# EAGLE design DAUGHTER_SENSOR (EAGLE 7.6.0)
DAUGHTER CARD SENSORS

## Sheet 1 of 3: HDK INTERFACE
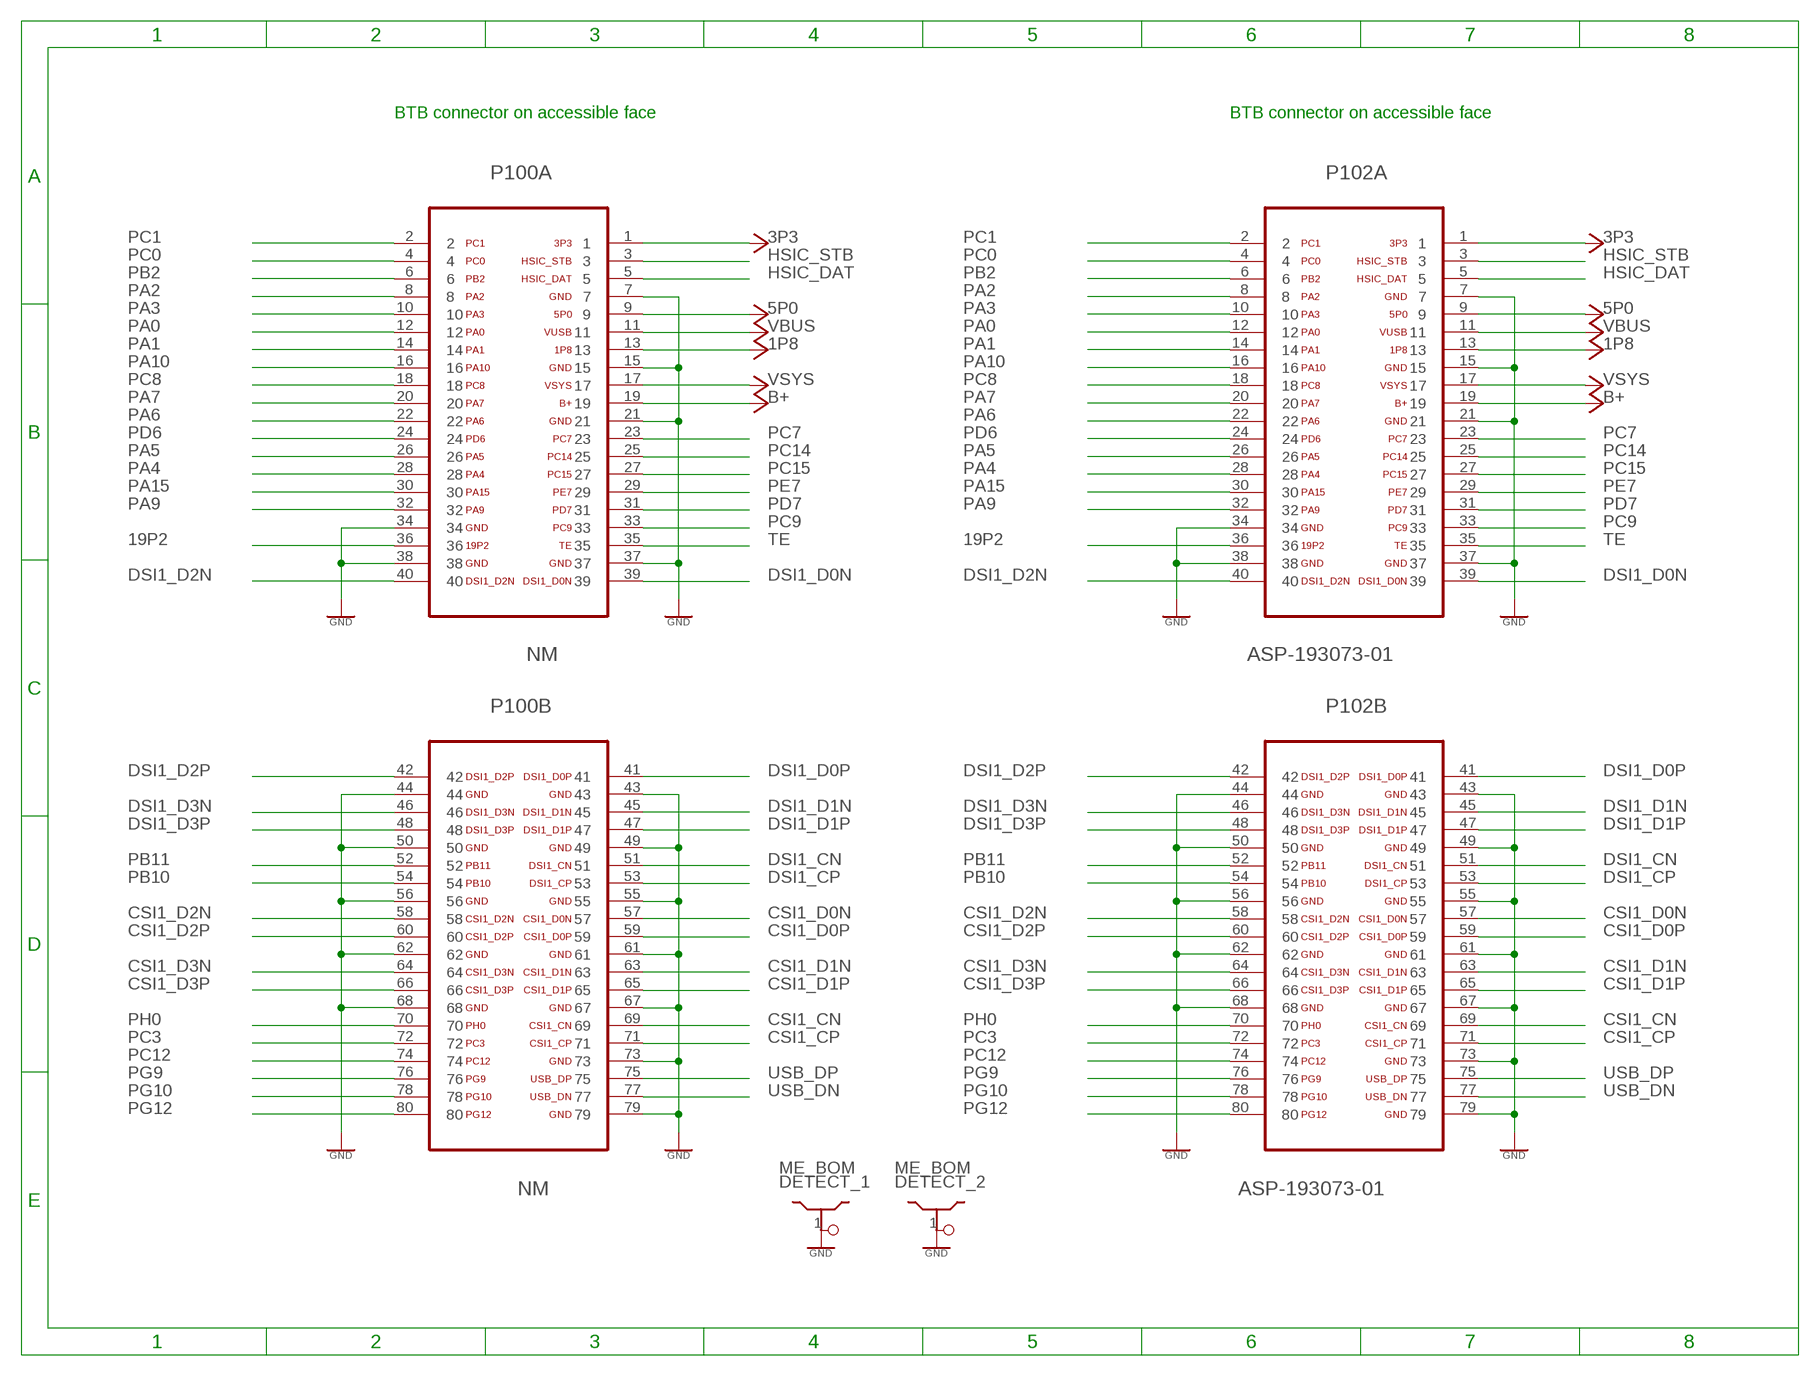
[diagram p0: schematic, sheet 1]

### Parts
DETECT_1  ME_BOM  SHIELDDETECT  [PLUG]
DETECT_2  ME_BOM  SHIELDDETECT  [PLUG]
P100  NM  CLM-140-02-L-D-KGOLD  [CLM-140-02-L-D-K_GOLD]
P102  ASP-193073-01  FTMH-140-02-L-DV-ES-P-TR  [FTMH-140-02-L-DV-ES-P-TR]

### Nets
1P8: P100.13 P102.13 ; also sheet 2,3
3P3: P100.1 P102.1 ; also sheet 2,3
5P0: P100.9 P102.9
19P2: P100.36 P102.36
B+: P100.19 P102.19
CSI1_CN: P100.69 P102.69
CSI1_CP: P100.71 P102.71
CSI1_D0N: P100.57 P102.57
CSI1_D0P: P100.59 P102.59
CSI1_D1N: P100.63 P102.63
CSI1_D1P: P100.65 P102.65
CSI1_D2N: P100.58 P102.58
CSI1_D2P: P100.60 P102.60
CSI1_D3N: P100.64 P102.64
CSI1_D3P: P100.66 P102.66
DSI1_CN: P100.51 P102.51
DSI1_CP: P100.53 P102.53
DSI1_D0N: P100.39 P102.39
DSI1_D0P: P100.41 P102.41
DSI1_D1N: P100.45 P102.45
DSI1_D1P: P100.47 P102.47
DSI1_D2N: P100.40 P102.40
DSI1_D2P: P100.42 P102.42
DSI1_D3N: P100.46 P102.46
DSI1_D3P: P100.48 P102.48
GND: DETECT_1.1 DETECT_2.1 P100.7 P100.15 P100.21 P100.34 P100.37 P100.38 P100.43 P100.44 P100.49 P100.50 P100.55 P100.56 P100.61 P100.62 P100.67 P100.68 P100.73 P100.79 P102.7 P102.15 P102.21 P102.34 P102.37 P102.38 P102.43 P102.44 P102.49 P102.50 P102.55 P102.56 P102.61 P102.62 P102.67 P102.68 P102.73 P102.79 ; also sheet 2,3
HSIC_DAT: P100.5 P102.5
HSIC_STB: P100.3 P102.3
PA0: P100.12 P102.12
PA1: P100.14 P102.14
PA2: P100.8 P102.8
PA3: P100.10 P102.10
PA4: P100.28 P102.28
PA5: P100.26 P102.26
PA6: P100.22 P102.22
PA7: P100.20 P102.20
PA9: P100.32 P102.32
PA10: P100.16 P102.16
PA15: P100.30 P102.30
PB2: P100.6 P102.6
PB10: P100.54 P102.54 ; also sheet 2
PB11: P100.52 P102.52 ; also sheet 2
PC0: P100.4 P102.4 ; also sheet 3
PC1: P100.2 P102.2 ; also sheet 3
PC3: P100.72 P102.72 ; also sheet 3
PC7: P100.23 P102.23
PC8: P100.18 P102.18
PC9: P100.33 P102.33
PC12: P100.74 P102.74
PC14: P100.25 P102.25
PC15: P100.27 P102.27
PD6: P100.24 P102.24
PD7: P100.31 P102.31
PE7: P100.29 P102.29
PG9: P100.76 P102.76 ; also sheet 2
PG10: P100.78 P102.78 ; also sheet 3
PG12: P100.80 P102.80
PH0: P100.70 P102.70
TE: P100.35 P102.35
USB_DN: P100.77 P102.77
USB_DP: P100.75 P102.75
VBUS: P100.11 P102.11
VSYS: P100.17 P102.17

### Notes on the sheet
- BTB connector on accessible face | BTB connector on accessible face

## Sheet 2 of 3: Identification
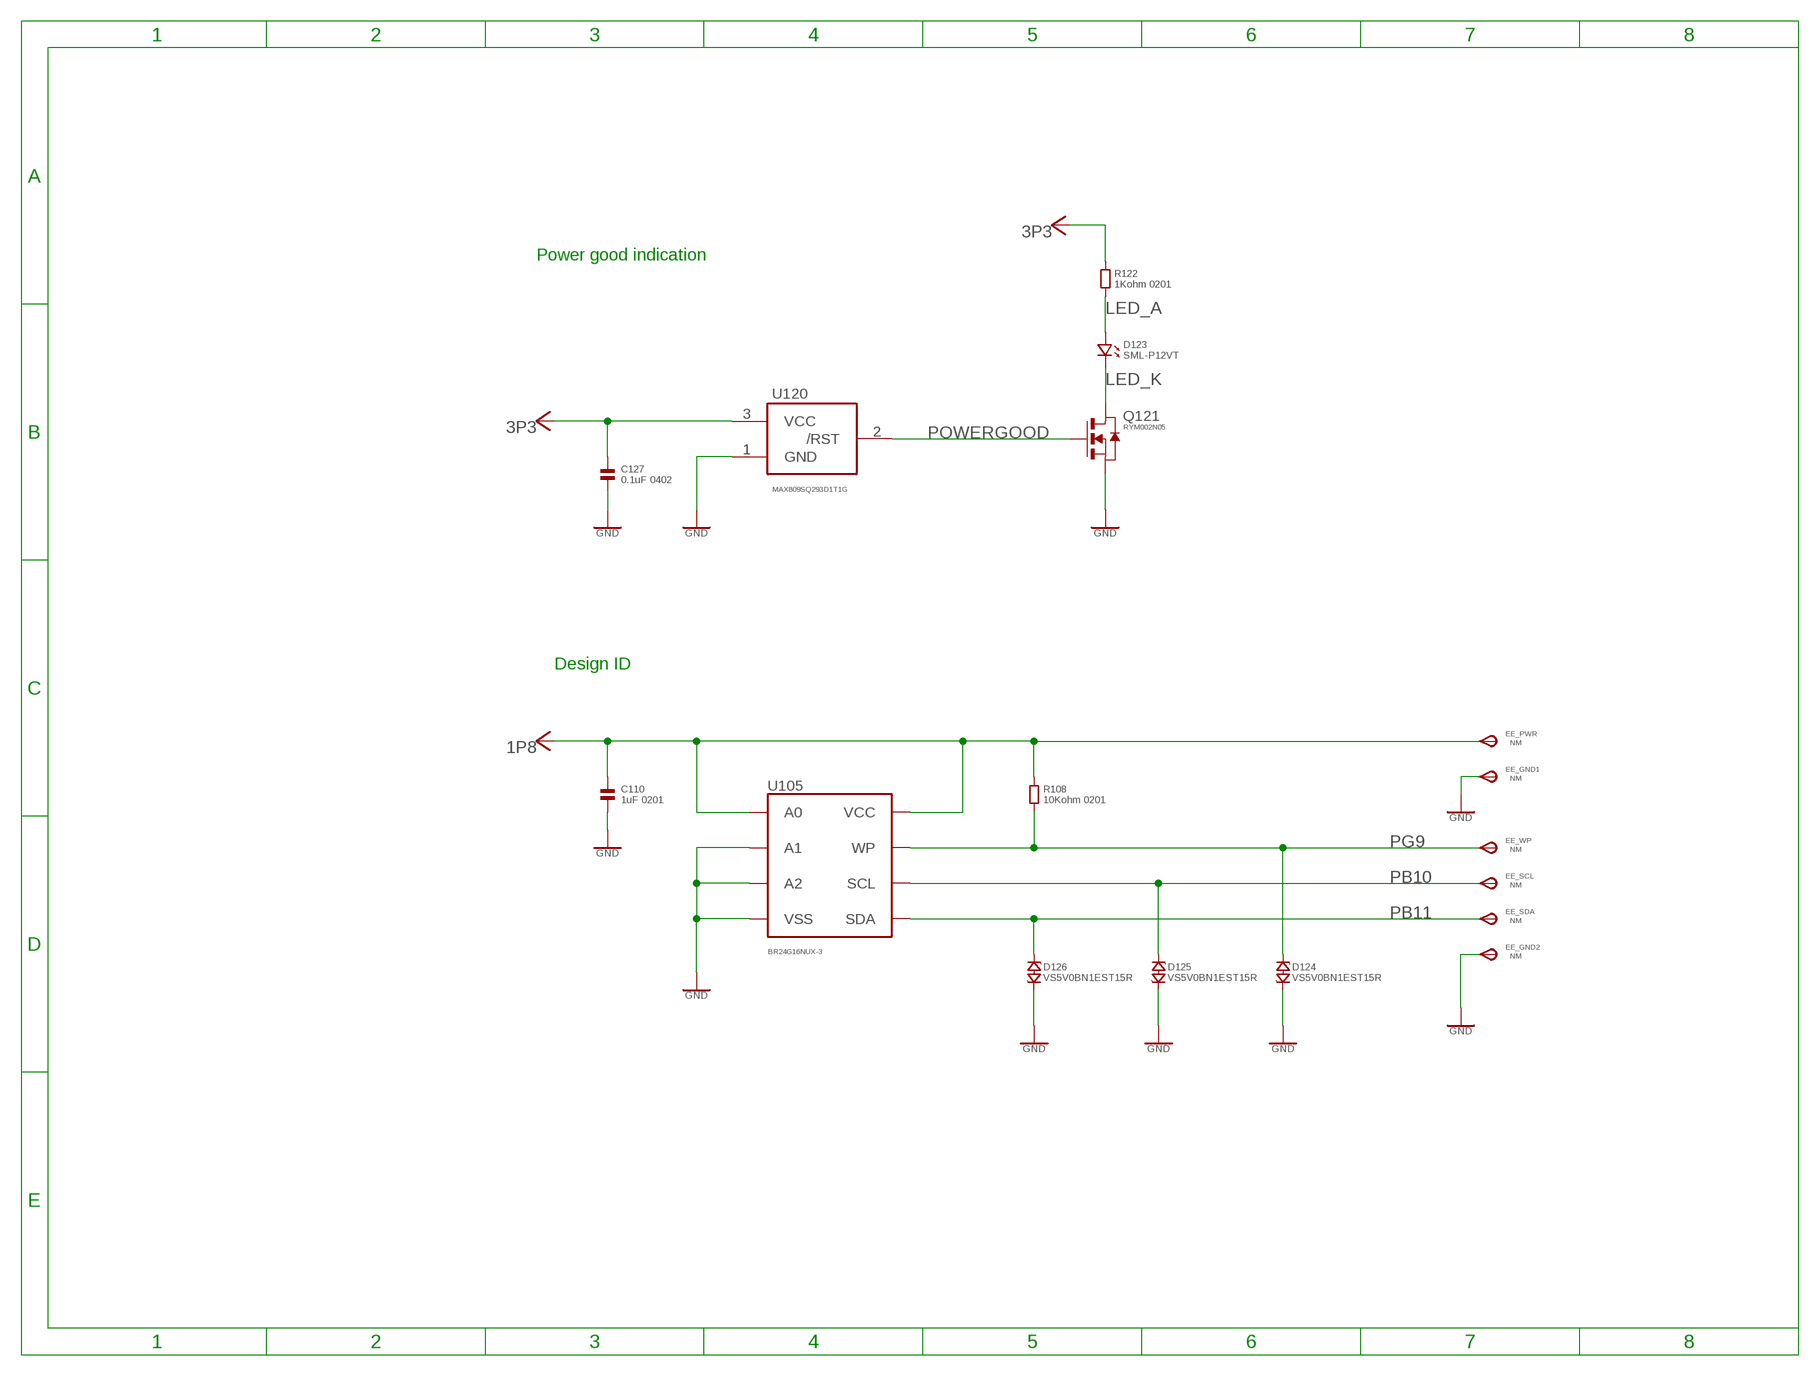
[diagram p1: schematic, sheet 2]

### Parts
C110  1uF 0201  CAPACITOR.0201  [0201]
C127  0.1uF 0402  CAPACITOR.0402  [0402]
D123  SML-P12VT  LED.0503  [0503.LED]
D124  VS5V0BN1EST15R  ESD_VARISTOR.0201  [CHIP_0201]
D125  VS5V0BN1EST15R  ESD_VARISTOR.0201  [CHIP_0201]
D126  VS5V0BN1EST15R  ESD_VARISTOR.0201  [CHIP_0201]
EE_GND1  NM  TPSTP11R  [TP11R]
EE_GND2  NM  TPSTP11R  [TP11R]
EE_PWR  NM  TPSTP11R  [TP11R]
EE_SCL  NM  TPSTP11R  [TP11R]
EE_SDA  NM  TPSTP11R  [TP11R]
EE_WP  NM  TPSTP11R  [TP11R]
Q121  RYM002N05  FET-NRYM002N05  [VMT3]
R108  10Kohm 0201  RESISTOR.0201  [0201]
R122  1Kohm 0201  RESISTOR.0201  [0201]
U105  BR24G16NUX-3  EEPROMDFN8  [DFN-8]
U120  MAX809SQ293D1T1G  MAX809  [SC70-3L]

### Nets
1P8: C110.1 EE_PWR.TP(PP) R108.1 U105.P$1(A0) U105.P$8(VCC) ; also sheet 1,3
3P3: C127.1 R122.1 U120.3(VCC) ; also sheet 1,3
GND: C110.2 C127.2 D124.P$2 D125.P$2 D126.P$2 EE_GND1.TP(PP) EE_GND2.TP(PP) Q121.2(S) U105.P$2(A1) U105.P$3(A2) U105.P$4(VSS) U105.P$9(VSS) U120.1(GND) ; also sheet 1,3
LED_A: D123.P$1 R122.2
LED_K: D123.P$2 Q121.3(D)
PB10: D125.P$1 EE_SCL.TP(PP) U105.P$6(SCL) ; also sheet 1
PB11: D126.P$1 EE_SDA.TP(PP) U105.P$5(SDA) ; also sheet 1
PG9: D124.P$1 EE_WP.TP(PP) R108.2 U105.P$7(WP) ; also sheet 1
POWERGOOD: Q121.1(G) U120.2(/RST)

### Notes on the sheet
- Power good indication
- Design ID

## Sheet 3 of 3: SENSOR
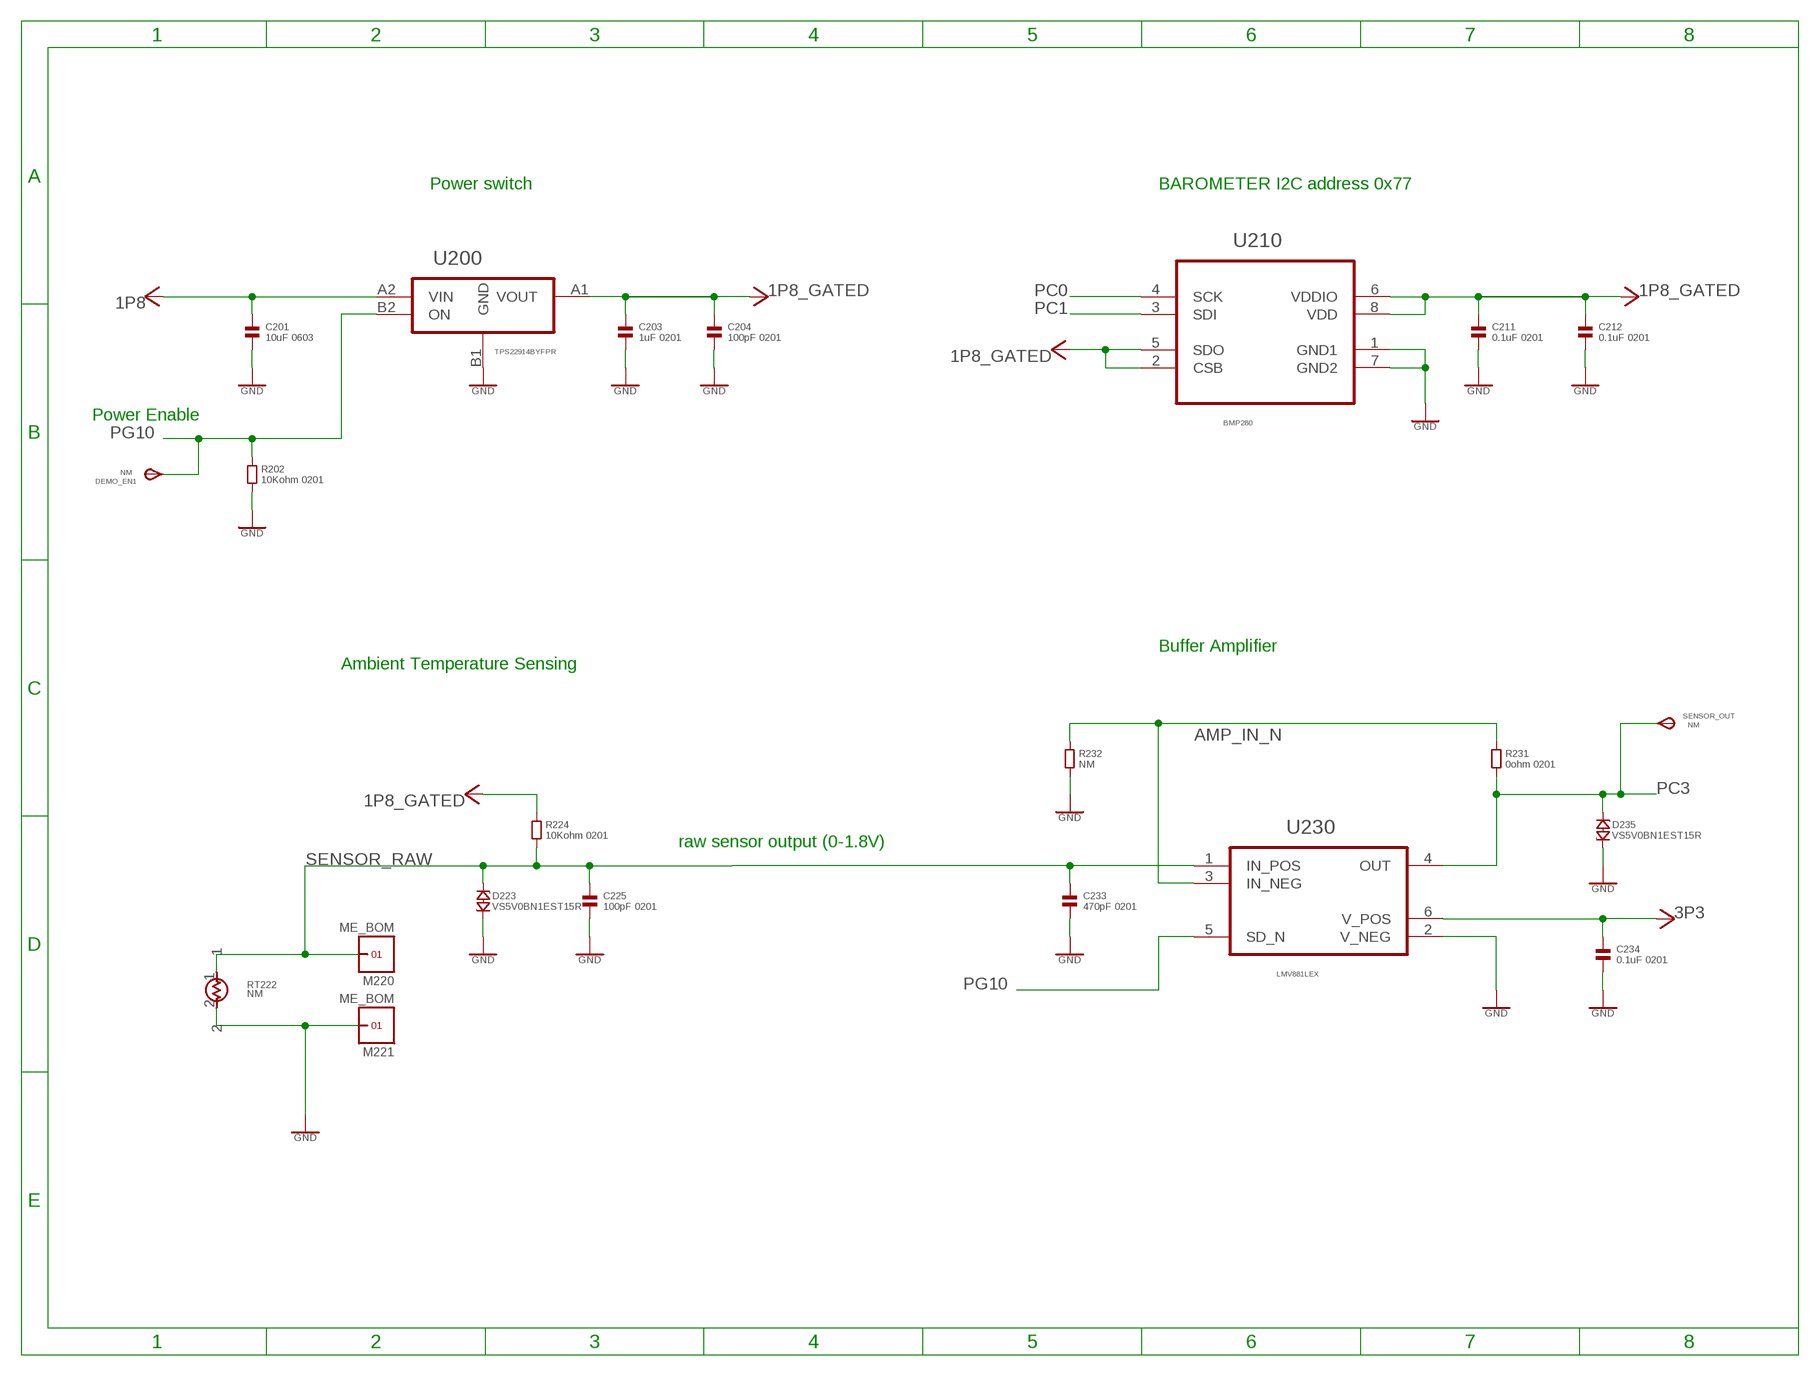
[diagram p2: schematic, sheet 3]

### Parts
C201  10uF 0603  CAPACITOR.0603  [0603]
C203  1uF 0201  CAPACITOR.0201  [0201]
C204  100pF 0201  CAPACITOR.0201  [0201]
C211  0.1uF 0201  CAPACITOR.0201  [0201]
C212  0.1uF 0201  CAPACITOR.0201  [0201]
C225  100pF 0201  CAPACITOR.0201  [0201]
C233  470pF 0201  CAPACITOR.0201  [0201]
C234  0.1uF 0201  CAPACITOR.0201  [0201]
D223  VS5V0BN1EST15R  ESD_VARISTOR.0201  [CHIP_0201]
D235  VS5V0BN1EST15R  ESD_VARISTOR.0201  [CHIP_0201]
DEMO_EN1  NM  TPSTP11R  [TP11R]
M220  ME_BOM  UNVERSA_CONTACT  [UNIVERSAL_CONTACT]
M221  ME_BOM  UNVERSA_CONTACT  [UNIVERSAL_CONTACT]
R202  10Kohm 0201  RESISTOR.0201  [0201]
R224  10Kohm 0201  RESISTOR.0201  [0201]
R231  0ohm 0201  RESISTOR.0201  [0201]
R232  NM  RESISTOR.0201  [0201]
RT222  NM  THERMISTOR  [0201]
SENSOR_OUT  NM  TPSTP11R  [TP11R]
U200  TPS22914BYFPR  [BGA0_75SQ_PS0_4_P4]
U210  BMP280  [LGA2X2_5PS0_65_P8]
U230  LMV881LEX  [DFN1_5X1PS0_5P6]

### Nets
1P8: C201.1 U200.A2(VIN) ; also sheet 1,2
1P8_GATED: C203.1 C204.1 C211.1 C212.1 R224.1 U200.A1(VOUT) U210.2(CSB) U210.5(SDO) U210.6(VDDIO) U210.8(VDD)
3P3: C234.1 U230.6(V_POS) ; also sheet 1,2
AMP_IN_N: R231.1 R232.1 U230.3(IN_NEG)
GND: C201.2 C203.2 C204.2 C211.2 C212.2 C225.2 C233.2 C234.2 D223.P$2 D235.P$2 M221.G1 R202.2 R232.2 RT222.2 U200.B1(GND) U210.1(GND1) U210.7(GND2) U230.2(V_NEG) ; also sheet 1,2
PC0: U210.4(SCK) ; also sheet 1
PC1: U210.3(SDI) ; also sheet 1
PC3: D235.P$1 R231.2 SENSOR_OUT.TP(PP) U230.4(OUT) ; also sheet 1
PG10: DEMO_EN1.TP(PP) R202.1 U200.B2(ON) U230.5(SD_N) ; also sheet 1
SENSOR_RAW: C225.1 C233.1 D223.P$1 M220.G1 R224.2 RT222.1 U230.1(IN_POS)

### Notes on the sheet
- Power switch | BAROMETER I2C address 0x77
- Power Enable
- Buffer Amplifier
- Ambient Temperature Sensing
- raw sensor output (0-1.8V)

## Library data of the parts
C110 C127 C201 C203 C204 C211 C212 C225 C233 C234 = MOTO_LIB:CAPACITOR: Ceramic Capacitor, Generic
D123 = MOTO_LIB:LED: LED GENERIC, single, 2 pin; MPN: SML-P12VT; SUPPLIER: ROHM
D124-D126 D223 D235 = MOTO_LIB:ESD_VARISTOR: GENERIC varistor,single, 2 pin; MPN: VS5V0BN1EST15R; SUPPLIER: ROHM
DEMO_EN1 EE_GND1 EE_GND2 EE_PWR EE_SCL EE_SDA EE_WP SENSOR_OUT = MOTO_LIB:TPS: TEST Point, 1mm diameter, gold
DETECT_1 DETECT_2 = MOTO_LIB:SHIELD: Shield, Custom; MPN: refer to ME BOM; SUPPLIER: ref to ME BOM
M220 M221 = MOTO_LIB:UNVERSA_CONTACT: Universal contact, Generic; MPN: refer to ME BOM; SUPPLIER: ref to ME BOM
P100 = MOTO_LIB:CLM-140-02-L-D-K: MICRO SOCKET, 1.0MM pitch, SMD, 2X40WAY, Female; MPN: CLM-140-02-L-D-K; SUPPLIER: SAMTEC
P102 = MOTO_LIB:FTMH-140-02-L-DV-ES-P-TR: MICRO SOCKET, 1.0MM, SMD, 2X40WAY, MALE; MPN: ASP-193073-01; SUPPLIER: SAMTEC
Q121 = MOTO_LIB:FET-N: Generic NMOS FET; MPN: RYM002N05; SUPPLIER: ROHM
R108 R122 R202 R224 R231 R232 = MOTO_LIB:RESISTOR: Resistor - Generic
RT222 = MOTO_LIB:THERMISTOR: Thmistor, NTC 10Khm 3%, 0201; MPN: NCP03XV103XV103E05RL/NTCG0603UH103HT; SUPPLIER: MURARA/TDK
U105 = MOTO_LIB:EEPROM: I2C EE PROM, 8 pin; MPN: BR24G16NUX-3; SUPPLIER: ROHM
U120 = MOTO_LIB:MAX809: 3-Pin Microprocessor Reset Circuit; MPN: MAX809SQ293D1T1; SUPPLIER: ON-SEMI
U200 = MOTO_LIB:TPS22914BYFPR: 5V load switch; MPN: TPS22914BYFPR; SUPPLIER: TI
U210 = MOTO_LIB:BMP280: BAROMETER BMP280; MPN: BMP280; SUPPLIER: BOSCH
U230 = MOTO_LIB:LMV881LEX: LOW NOISE OPAMP with Shutdown.; MPN: LMV881LEX; SUPPLIER: TI

## Board
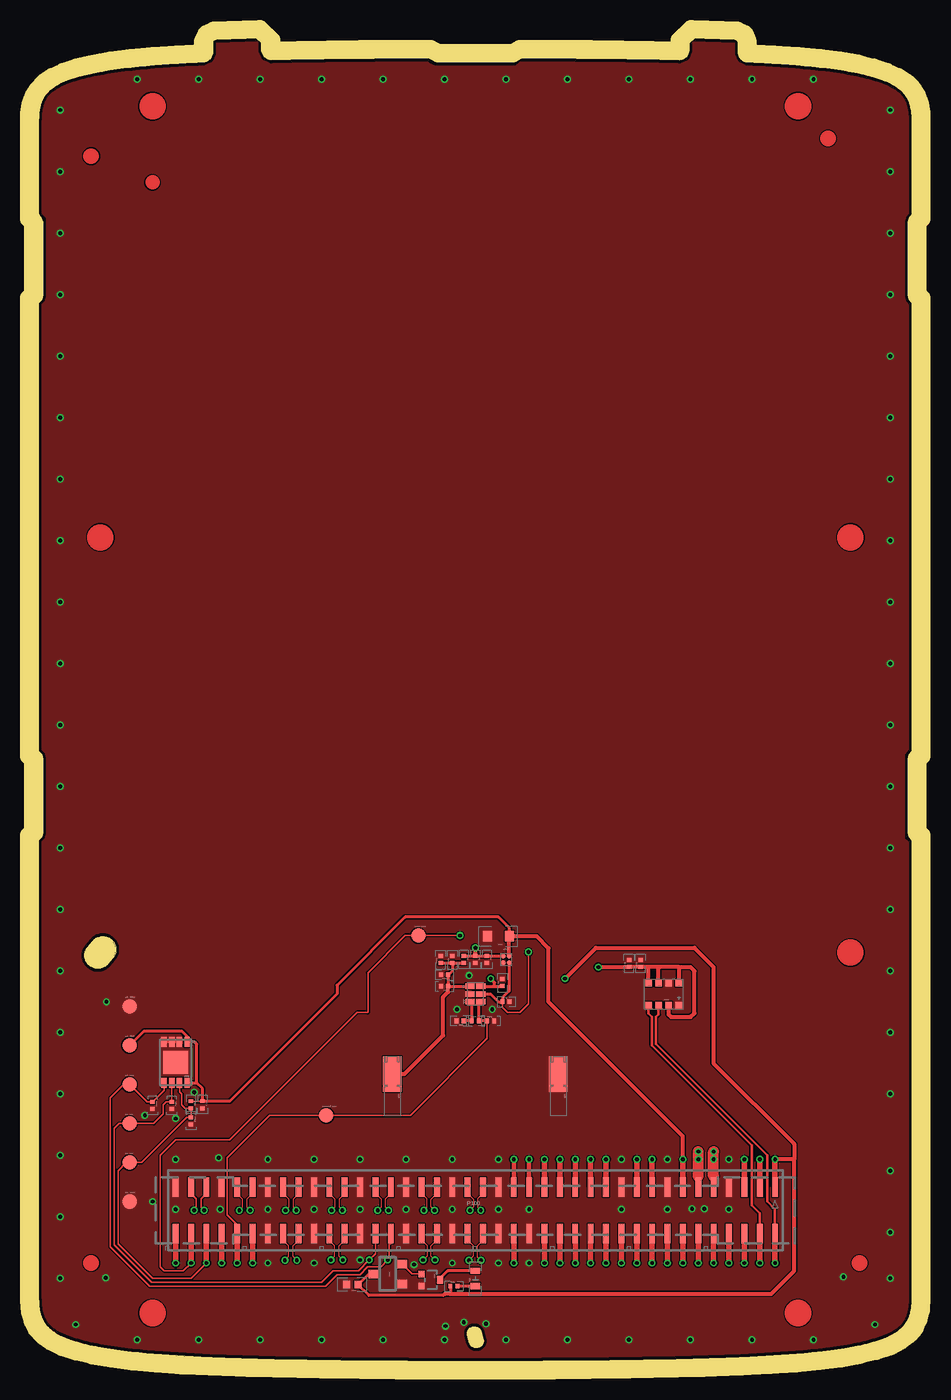
[diagram p3: board, top side]
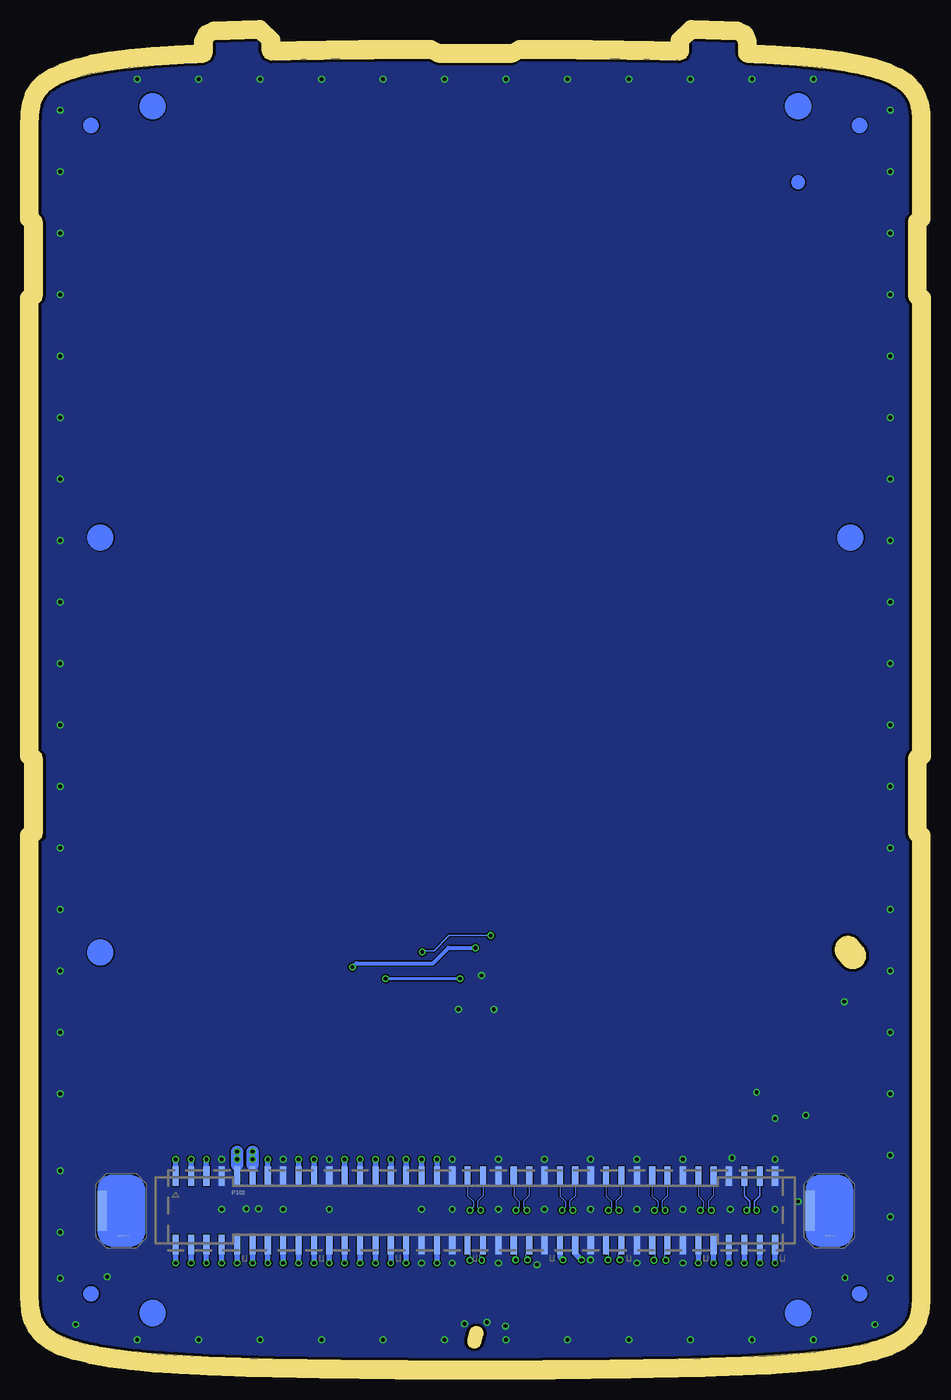
[diagram p4: board, bottom side, seen from below]

Size 56.85 x 86.03 mm. Coordinates in mm from the lower left corner, seen from the top.
Outline: 357 segments
Copper layers (1*2*15*16): Top 0.02mm / dielectric 0.045mm / Route2 0.016mm / dielectric 0.711mm / Route15 0.016mm / dielectric 0.045mm / Bottom 0.02mm
Design rules "constraint": minimum track width 0.08mm, minimum drill 0.25mm, track to track 0.08mm, track to pad 0.08mm, pad to pad 0.08mm, via to via 0.08mm, smd to smd 0.08mm, copper to edge 0.2mm, drill to drill 0.2mm, minimum pad ring 0.1mm, minimum via ring 0.1mm, stop-mask expansion 0mil, vias tented up to drill 0.25mm, thermal gap 0mil
Milling: 125 lines

### Footprints (pad centres in the part's own frame; a part is rotated, then mirrored left to right if it is on the bottom)
0201 = smd 0.25 x 0.3: 1 -0.23,0; 2 0.23,0
0402 = smd 0.45 x 0.5: 1 -0.37,0; 2 0.37,0
0603 = smd 0.58 x 0.68: 1 -0.71,0; 2 0.71,0
0503.LED = smd 0.4 x 0.6: P$1 -0.495,0; P$2 0.495,0
CHIP_0201 = smd 0.25 x 0.3: P$1 -0.23,0; P$2 0.23,0
TP11R = smd 0.95 x 0.95: TP 0,0
PLUG = smd 0.6 x 2.6: 1 -1.25,0
UNIVERSAL_CONTACT = smd 2.3 x 1.2: G1 -0.8,0
CLM-140-02-L-D-K_GOLD = smd 0.38 x 1.27: 1 19.5,1.52; 2 19.5,-1.52; 3 18.5,1.52; 4 18.5,-1.52; 5 17.5,1.52; 6 17.5,-1.52; 7 16.5,1.52; 8 16.5,-1.52; 9 15.5,1.52; 10 15.5,-1.52; 11 14.5,1.52; 12 14.5,-1.52; 13 13.5,1.52; 14 13.5,-1.52; 15 12.5,1.52; 16 12.5,-1.52; 17 11.5,1.52; 18 11.5,-1.52; 19 10.5,1.52; 20 10.5,-1.52; 21 9.5,1.52; 22 9.5,-1.52; 23 8.5,1.52; 24 8.5,-1.52; 25 7.5,1.52; 26 7.5,-1.52; 27 6.5,1.52; 28 6.5,-1.52; 29 5.5,1.52; 30 5.5,-1.52; 31 4.5,1.52; 32 4.5,-1.52; 33 3.5,1.52; 34 3.5,-1.52; 35 2.5,1.52; 36 2.5,-1.52; 37 1.5,1.52; 38 1.5,-1.52; 39 0.5,1.52; 40 0.5,-1.52; 41 -0.5,1.52; 42 -0.5,-1.52; 43 -1.5,1.52; 44 -1.5,-1.52; 45 -2.5,1.52; 46 -2.5,-1.52; 47 -3.5,1.52; 48 -3.5,-1.52; 49 -4.5,1.52; 50 -4.5,-1.52; 51 -5.5,1.52; 52 -5.5,-1.52; 53 -6.5,1.52; 54 -6.5,-1.52; 55 -7.5,1.52; 56 -7.5,-1.52; 57 -8.5,1.52; 58 -8.5,-1.52; 59 -9.5,1.52; 60 -9.5,-1.52; 61 -10.5,1.52; 62 -10.5,-1.52; 63 -11.5,1.52; 64 -11.5,-1.52; 65 -12.5,1.52; 66 -12.5,-1.52; 67 -13.5,1.52; 68 -13.5,-1.52; 69 -14.5,1.52; 70 -14.5,-1.52; 71 -15.5,1.52; 72 -15.5,-1.52; 73 -16.5,1.52; 74 -16.5,-1.52; 75 -17.5,1.52; 76 -17.5,-1.52; 77 -18.5,1.52; 78 -18.5,-1.52; 79 -19.5,1.52; 80 -19.5,-1.52
FTMH-140-02-L-DV-ES-P-TR = smd 0.4 x 1.263: 1 -19.5,2.223; 2 -19.5,-2.223; 3 -18.5,2.223; 4 -18.5,-2.223; 5 -17.5,2.223; 6 -17.5,-2.223; 7 -16.5,2.223; 8 -16.5,-2.223; 9 -15.5,2.223; 10 -15.5,-2.223; 11 -14.5,2.223; 12 -14.5,-2.223; 13 -13.5,2.223; 14 -13.5,-2.223; 15 -12.5,2.223; 16 -12.5,-2.223; 17 -11.5,2.223; 18 -11.5,-2.223; 19 -10.5,2.223; 20 -10.5,-2.223; 21 -9.5,2.223; 22 -9.5,-2.223; 23 -8.5,2.223; 24 -8.5,-2.223; 25 -7.5,2.223; 26 -7.5,-2.223; 27 -6.5,2.223; 28 -6.5,-2.223; 29 -5.5,2.223; 30 -5.5,-2.223; 31 -4.5,2.223; 32 -4.5,-2.223; 33 -3.5,2.223; 34 -3.5,-2.223; 35 -2.5,2.223; 36 -2.5,-2.223; 37 -1.5,2.223; 38 -1.5,-2.223; 39 -0.5,2.223; 40 -0.5,-2.223; 41 0.5,2.223; 42 0.5,-2.223; 43 1.5,2.223; 44 1.5,-2.223; 45 2.5,2.223; 46 2.5,-2.223; 47 3.5,2.223; 48 3.5,-2.223; 49 4.5,2.223; 50 4.5,-2.223; 51 5.5,2.223; 52 5.5,-2.223; 53 6.5,2.223; 54 6.5,-2.223; 55 7.5,2.223; 56 7.5,-2.223; 57 8.5,2.223; 58 8.5,-2.223; 59 9.5,2.223; 60 9.5,-2.223; 61 10.5,2.223; 62 10.5,-2.223; 63 11.5,2.223; 64 11.5,-2.223; 65 12.5,2.223; 66 12.5,-2.223; 67 13.5,2.223; 68 13.5,-2.223; 69 14.5,2.223; 70 14.5,-2.223; 71 15.5,2.223; 72 15.5,-2.223; 73 16.5,2.223; 74 16.5,-2.223; 75 17.5,2.223; 76 17.5,-2.223; 77 18.5,2.223; 78 18.5,-2.223; 79 19.5,2.223; 80 19.5,-2.223
VMT3 = smd 0.42 x 0.4: 1 -0.4,-0.6; 2 0.4,-0.6 | smd 0.52 x 0.4: 3 0,0.6
DFN-8 = smd 0.35 x 0.65: P$1 -0.75,-1.325; P$2 -0.25,-1.325; P$3 0.25,-1.325; P$4 0.75,-1.325; P$5 0.75,1.325; P$6 0.25,1.325; P$7 -0.25,1.325; P$8 -0.75,1.325 | smd 1.6 x 1.5: P$9 0,0
SC70-3L = smd 0.55 x 0.63: 1 -0.65,-0.94; 3 0,0.94 | smd 0.555 x 0.63: 2 0.65,-0.94
BGA0_75SQ_PS0_4_P4 = smd 0.32 x 0.32: A1 -0.2,0.2; A2 0.2,0.2; B1 -0.2,-0.2; B2 0.2,-0.2
LGA2X2_5PS0_65_P8 = smd 0.45 x 0.45: 1 -0.975,0.725; 2 -0.325,0.725; 3 0.325,0.725; 4 0.975,0.725; 5 0.975,-0.725; 6 0.325,-0.725; 7 -0.325,-0.725; 8 -0.975,-0.725
DFN1_5X1PS0_5P6 = smd 0.35 x 0.6: 1 0.5,0.35; 2 0,0.35; 3 -0.5,0.35; 4 -0.5,-0.35; 5 0,-0.35; 6 0.5,-0.35

### Placement (x,y rotation side)
C110  10.67,16.67 270 top
C127  20.42,4.97 180 top
C201  29.92,27.62 180 top
C203  29.17,26.12 270 top
C204  28.42,26.12 270 top
C211  39.17,25.87 90 top
C212  38.42,25.87 90 top
C225  26.17,26.12 90 top
C233  26.92,26.12 90 top
C234  30.17,24.62 90 top
D123  28.42,5.37 90 top
D124  9.92,15.62 270 top
D125  8.67,16.62 270 top
D126  7.42,16.62 270 top
D223  26.42,24.37 180 top
D235  29.42,22.12 0 top
DEMO_EN1  24.72,27.67 0 top
DETECT_1  51.45,9.77 0 bottom
DETECT_2  5.39,9.77 0 bottom
EE_GND1  5.92,10.37 0 top
EE_GND2  5.92,23.07 0 top
EE_PWR  5.92,20.53 0 top
EE_SCL  5.92,15.45 0 top
EE_SDA  5.92,17.99 0 top
EE_WP  5.92,12.91 0 top
M220  23.02,17.87 270 top
M221  33.82,17.87 270 top
P100  28.42,9.8 0 top
P102  28.42,9.8 0 bottom
Q121  25.52,5.27 270 top
R108  9.92,16.67 270 top
R122  27.02,4.87 0 top
R202  30.42,23.37 0 top
R224  27.67,26.12 270 top
R231  28.42,22.12 0 top
R232  27.42,22.12 180 top
RT222  26.42,25.12 180 top
SENSOR_OUT  18.72,15.97 0 top
U105  8.92,19.42 180 top
U120  22.72,5.67 90 top
U200  30.42,26.12 0 top
U210  40.67,23.87 180 top
U230  28.42,23.87 90 top

### Tracks (layer width: path | path; a pad name or v marks a point on that pad's centre or on a via)
1P8  (via drill 0.25)
  Top 0.1: R108.1 C110.1
  Top 0.2: EE_PWR.TP 6.86,21.47 9.32,21.47 9.67,21.12 U105.P$1 10.15,20.75 10.3,20.6 10.3,18.1 | U105.P$8 10.3,18.1 | 10.3,18.1 10.67,17.72 C110.1 12.45,16.9 19.42,23.87 19.42,24.44 23.86,28.87 29.92,28.87 30.63,28.16 C201.1
  Top 0.25: C201.1 32.42,27.62 33.19,26.86 33.19,23.36 41.92,14.62 v41.92,13.12 | U200.A2 C201.1
  Top 0.35: C201.1 | P100.13 v41.92,13.12
  Bottom 0.35: P102.13 v41.92,13.12
1P8_GATED  (via drill 0.25)
  Top 0.2: U200.A1 30.19,26.35 C203.1 C204.1 R224.1
  Top 0.25: C204.1 v28.42,26.87 | v36.42,25.62 38.4,25.62 C212.1 C211.1 39.19,25.62 39.67,25.62 | 41.65,25.62 41.65,24.62 U210.8 | U210.2 41,22.55 41.17,22.37 42.42,22.37 42.67,22.62 42.67,25.37 | 42.67,25.37 42.42,25.62 | 42.42,25.62 42.67,25.37 | 41.65,25.62 41.67,25.62 42.42,25.62 | 41.65,25.62 40.42,25.62 | 40.42,25.62 39.67,25.62 | U210.6 40.35,25.55 40.42,25.62 | U210.5 39.7,25.6 39.67,25.62
  Bottom 0.25: v28.42,26.87 30.17,26.87 31.17,25.87 36.17,25.87 v36.42,25.62
3P3  (via drill 0.25)
  Top 0.2: U230.6 29.67,24.37 | 29.67,24.37 30.15,24.37 C234.1 | 29.67,24.37 29.67,24.62 v29.42,24.87 | U120.3 21.49,5.67 C127.1 21.49,4.27 26.32,4.27 26.42,4.37 | R122.1 26.79,4.37
  Top 0.25: v34.26,24.87 36.26,26.87 42.67,26.87 43.92,25.62 43.92,19.37 49.17,14.12 49.17,13.12 | 49.17,13.12 v47.92,13.12 | 26.42,4.37 26.79,4.37 47.67,4.37 49.17,5.87 49.17,13.12
  Top 0.35: P100.1 v47.92,13.12
  Bottom 0.2: v29.42,24.87 v34.26,24.87
  Bottom 0.35: P102.1 v47.92,13.12
5P0  (via drill 0.25)
  Top 0.25: P100.9 P102.9
  Top 0.7: P102.9 v43.92,13.62
  Bottom 0.4: P102.9 43.92,12.77
  Bottom 0.8: 43.92,12.77 v43.92,13.12 v43.92,13.62
19P2  (via drill 0.25)
  Top 0.35: P100.36 v30.92,6.37
  Bottom 0.35: v30.92,6.37 P102.36
AMP_IN_N
  Top 0.2: R232.1 R231.1 28.19,23.25 U230.3
B+  (via drill 0.25)
  Top 0.35: P100.19 v38.92,13.12
  Bottom 0.35: v38.92,13.12 P102.19
CSI1_CN  (via drill 0.25)
  Top 0.08: P100.69 13.92,10.9 13.57,10.55 13.57,10 v13.77,9.8
  Bottom 0.08: P102.69 13.92,10.75 13.57,10.4 13.57,10 v13.77,9.8
CSI1_CP  (via drill 0.25)
  Top 0.08: P100.71 12.92,10.9 13.29,10.53 13.29,10.02 v13.07,9.8
  Bottom 0.08: P102.71 12.92,10.75 13.27,10.4 13.27,10 v13.07,9.8
CSI1_D0N  (via drill 0.25)
  Top 0.08: P100.57 19.92,10.9 19.55,10.53 19.55,10.02 v19.77,9.8
  Bottom 0.08: P102.57 19.92,10.75 19.57,10.4 19.57,10 v19.77,9.8
CSI1_D0P  (via drill 0.25)
  Top 0.08: P100.59 18.92,10.9 19.27,10.55 19.27,10 v19.07,9.8
  Bottom 0.08: P102.59 18.92,10.75 19.29,10.38 19.29,10.02 v19.07,9.8
CSI1_D1N  (via drill 0.25)
  Top 0.08: P100.63 16.92,10.9 16.55,10.53 16.55,10.02 v16.77,9.8
  Bottom 0.08: P102.63 16.92,10.75 16.55,10.38 16.55,10.02 v16.77,9.8
CSI1_D1P  (via drill 0.25)
  Top 0.08: 15.92,10.9 16.27,10.55 16.27,10 v16.07,9.8
  Top 0.1: P100.65 15.92,10.9
  Bottom 0.08: P102.65 15.92,10.75 16.27,10.4 16.27,10 v16.07,9.8
CSI1_D2N  (via drill 0.25)
  Top 0.08: P100.58 19.92,7.85 19.57,7.5 19.57,6.8 v19.8,6.58
  Bottom 0.08: P102.58 19.92,7.17 19.72,6.97 19.72,6.65 v19.8,6.58
CSI1_D2P  (via drill 0.25)
  Top 0.08: P100.60 18.92,7.85 19.27,7.5 19.27,6.82 v19.03,6.58
  Bottom 0.08: P102.60 18.92,7.15 19.12,6.95 19.12,6.67 v19.03,6.58
CSI1_D3N  (via drill 0.25)
  Top 0.08: P100.64 16.92,7.85 16.57,7.5 16.57,6.8 v16.81,6.57
  Bottom 0.08: P102.64 16.92,7.12 16.72,6.92 16.72,6.65 v16.81,6.57
CSI1_D3P  (via drill 0.25)
  Top 0.08: P100.66 15.92,7.85 16.27,7.5 16.27,6.8 v16.03,6.57
  Bottom 0.08: P102.66 15.92,7.12 16.12,6.92 16.12,6.65 v16.03,6.57
DSI1_CN  (via drill 0.25)
  Top 0.08: 22.92,10.9 22.55,10.53 22.55,10.02 v22.77,9.8
  Top 0.1: P100.51 22.92,10.9
  Bottom 0.08: P102.51 22.92,10.75 22.57,10.4 22.57,10 v22.77,9.8
DSI1_CP  (via drill 0.25)
  Top 0.08: P100.53 21.92,10.9 22.27,10.55 22.27,10 v22.07,9.8
  Bottom 0.08: P102.53 21.92,10.75 22.29,10.39 22.29,10.02 v22.07,9.8
DSI1_D0N  (via drill 0.25)
  Top 0.08: P100.39 28.92,10.9 28.57,10.55 28.57,10 v28.77,9.8
  Bottom 0.08: P102.39 28.92,10.75 28.55,10.38 28.55,10.02 v28.77,9.8
DSI1_D0P  (via drill 0.25)
  Top 0.08: P100.41 27.92,10.9 28.29,10.53 28.29,10.02 v28.07,9.8
  Bottom 0.08: P102.41 27.92,10.75 28.27,10.4 28.27,10 v28.07,9.8
DSI1_D1N  (via drill 0.25)
  Top 0.08: P100.45 25.92,10.9 25.55,10.53 25.55,10.02 v25.77,9.8
  Bottom 0.08: P102.45 25.92,10.75 25.57,10.4 25.57,10 v25.77,9.8
DSI1_D1P  (via drill 0.25)
  Top 0.08: P100.47 24.92,10.9 25.27,10.55 25.27,10 v25.07,9.8
  Bottom 0.08: P102.47 24.92,10.75 25.29,10.38 25.29,10.02 v25.07,9.8
DSI1_D2N  (via drill 0.25)
  Top 0.08: P100.40 28.92,7.85 28.57,7.5 28.57,6.76 v28.78,6.56
  Bottom 0.08: P102.40 28.92,7.17 28.72,6.97 28.72,6.61 v28.78,6.56
DSI1_D2P  (via drill 0.25)
  Top 0.08: P100.42 27.92,7.85 28.29,7.48 28.29,6.84 v28.01,6.56
  Bottom 0.08: P102.42 27.92,7.15 28.12,6.95 28.12,6.67 v28.01,6.56
DSI1_D3N  (via drill 0.25)
  Top 0.08: P100.46 25.92,7.87 25.56,7.5 25.55,6.82 v25.8,6.58
  Bottom 0.08: P102.46 25.92,7.17 25.72,6.97 25.72,6.65 v25.8,6.58
DSI1_D3P  (via drill 0.25)
  Top 0.08: P100.48 24.92,7.87 25.27,7.52 25.27,6.82 v25.03,6.58
  Bottom 0.08: P102.48 24.92,7.15 25.12,6.95 25.12,6.67 v25.03,6.58
GND  (via drill 0.25)
  Top 0.2: U105.P$4 U105.P$3 U105.P$2
  other vias: 14.42,1.37 10.42,1.37 6.42,1.37 22.42,1.37 18.42,1.37 26.42,1.37 30.42,1.37 34.42,1.37 38.42,1.37 42.42,1.37 46.42,1.37 50.42,1.37 54.42,2.37 55.42,8.37 55.42,5.37 55.42,12.37 55.42,17.37 55.42,21.37 55.42,25.37 55.42,29.37 55.42,33.37 55.42,37.37 55.42,41.37 55.42,45.37 55.42,49.37 55.42,53.37 55.42,57.37 55.42,61.37 55.42,65.37 55.42,69.37 55.42,73.37 55.42,77.37 55.42,81.37 50.42,83.37 46.42,83.37 42.42,83.37 38.42,83.37 34.42,83.37 30.42,83.37 26.42,83.37 22.42,83.37 18.42,83.37 14.42,83.37 10.42,83.37 6.42,83.37 1.42,81.37 1.42,77.37 1.42,73.37 1.42,69.37 1.42,65.37 1.42,61.37 1.42,57.37 1.42,53.37 1.42,49.37 1.42,45.37 1.42,41.37 1.42,37.37 1.42,33.37 1.42,29.37 1.42,25.37 4.42,23.37 1.42,21.37 1.42,17.37 1.42,13.37 1.42,9.37 1.42,5.37 2.42,2.37 8.92,13.12 11.72,13.22 14.92,13.12 17.92,13.12 20.92,13.12 23.92,13.12 26.92,13.12 29.92,13.12 29.92,9.87 31.92,9.87 26.92,9.87 23.92,9.87 20.92,9.87 17.92,9.87 14.92,9.87 11.82,9.87 8.92,9.87 7.42,10.37 8.92,15.77 10.12,17.47 14.92,6.37 17.92,6.37 20.92,6.57 24.42,6.27 26.92,6.37 29.92,6.37 31.92,6.37 44.92,9.87 42.52,9.9 43.32,9.9 40.92,9.87 37.92,9.87 37.92,13.12 40.92,13.12 44.92,13.12 29.52,22.87 28.02,25.07 27.22,22.87 6.92,15.97 29.12,2.42 27.67,2.52 26.47,2.27 52.37,5.47 4.37,5.42
  pour Top: 25.82,84.22 31.07,84.22 31.57,84.67 36.72,84.67 41.82,84.57 42.12,84.67 42.32,84.97 42.42,85.17 42.42,85.57 42.72,85.97 45.32,85.87 45.42,85.67 45.42,84.97 45.62,84.57 45.82,84.47 46.12,84.37 47.12,84.37 50.02,84.17 51.72,83.97 53.32,83.67 54.82,83.27 55.72,82.87 56.22,82.47 56.52,82.07 56.72,81.47 56.82,80.77 56.82,74.97 56.42,74.47 56.32,74.07 56.32,69.27 56.42,68.87 56.82,68.47 56.82,39.97 56.32,39.47 56.32,33.97 56.82,33.57 56.82,4.87 56.72,3.47 56.52,2.67 56.12,2.17 55.52,1.77 54.22,1.27 52.92,0.97 51.62,0.77 48.72,0.47 44.72,0.27 43.62,0.27 43.32,0.37 38.32,0.27 38.02,0.17 36.62,0.07 20.12,0.07 18.72,0.17 18.52,0.27 13.52,0.37 13.22,0.27 10.82,0.37 7.02,0.57 3.92,0.97 2.32,1.37 1.32,1.77 0.72,2.17 0.42,2.47 0.22,2.97 0.12,3.47 0.02,4.47 0.02,33.57 0.42,33.97 0.52,34.27 0.52,39.27 0.32,39.67 0.12,39.97 0.02,40.07 0.02,68.47 0.32,68.77 0.52,69.17 0.52,74.37 0.02,74.87 0.02,80.27 0.12,81.27 0.42,82.27 0.72,82.57 1.72,83.17 3.02,83.57 4.52,83.87 7.02,84.17 9.92,84.37 10.82,84.37 11.22,84.57 11.42,84.87 11.42,85.67 11.52,85.87 14.12,85.97 14.42,85.67 14.42,85.07 14.62,84.77 14.92,84.57 15.52,84.57 19.92,84.67 25.17,84.67 25.37,84.42
  pour Bottom: 25.82,84.27 31.02,84.27 31.42,84.47 31.62,84.67 36.72,84.67 41.82,84.57 42.12,84.67 42.32,84.97 42.42,85.17 42.42,85.57 42.72,85.97 45.32,85.87 45.42,85.67 45.42,84.97 45.62,84.57 45.82,84.47 46.12,84.37 47.12,84.37 50.02,84.17 51.72,83.97 53.32,83.67 54.82,83.27 55.72,82.87 56.22,82.47 56.52,82.07 56.72,81.47 56.82,80.77 56.82,74.97 56.42,74.47 56.32,74.07 56.32,69.27 56.42,68.87 56.82,68.47 56.82,39.97 56.32,39.47 56.32,33.97 56.82,33.57 56.82,4.87 56.72,3.47 56.52,2.67 56.12,2.17 55.52,1.77 54.22,1.27 52.92,0.97 51.62,0.77 48.72,0.47 44.72,0.27 43.62,0.27 43.32,0.37 38.32,0.27 38.02,0.17 36.62,0.07 20.12,0.07 18.72,0.17 18.52,0.27 13.52,0.37 13.22,0.27 10.82,0.37 7.02,0.57 3.92,0.97 2.32,1.37 1.32,1.77 0.72,2.17 0.42,2.47 0.22,2.97 0.12,3.47 0.02,4.47 0.02,33.57 0.42,33.97 0.52,34.27 0.52,39.27 0.32,39.67 0.12,39.97 0.02,40.07 0.02,68.47 0.32,68.77 0.52,69.17 0.52,74.37 0.02,74.87 0.02,80.27 0.12,81.27 0.42,82.27 0.72,82.57 1.72,83.17 3.02,83.57 4.52,83.87 7.02,84.17 9.92,84.37 10.82,84.37 11.22,84.57 11.42,84.87 11.42,85.67 11.52,85.87 14.12,85.97 14.42,85.67 14.42,85.07 14.62,84.77 14.92,84.57 15.52,84.57 19.92,84.67 25.32,84.67 25.62,84.37
HSIC_DAT  (via drill 0.25)
  Top 0.35: P100.5 v45.92,13.12
  Bottom 0.35: v45.92,13.12 P102.5
HSIC_STB  (via drill 0.25)
  Top 0.35: P100.3 v46.92,13.12
  Bottom 0.35: v46.92,13.12 P102.3
LED_A
  Top 0.1: R122.2
  Top 0.2: D123.P$1 R122.2
LED_K
  Top 0.2: D123.P$2 26.62,5.87 26.22,5.47 26.22,5.37 Q121.3
PA0  (via drill 0.25)
  Top 0.35: P100.12 v42.92,6.37
  Bottom 0.35: v42.92,6.37 P102.12
PA1  (via drill 0.25)
  Top 0.35: P100.14 v41.92,6.37
  Bottom 0.35: v41.92,6.37 P102.14
PA2  (via drill 0.25)
  Top 0.35: P100.8 v44.92,6.37
  Bottom 0.35: v44.92,6.37 P102.8
PA3  (via drill 0.25)
  Top 0.35: P100.10 v43.92,6.37
  Bottom 0.35: v43.92,6.37 P102.10
PA4  (via drill 0.25)
  Top 0.35: P100.28 v34.92,6.37
  Bottom 0.35: v34.92,6.37 P102.28
PA5  (via drill 0.25)
  Top 0.35: P100.26 v35.92,6.37
  Bottom 0.35: v35.92,6.37 P102.26
PA6  (via drill 0.25)
  Top 0.35: P100.22 v37.92,6.37
  Bottom 0.35: v37.92,6.37 P102.22
PA7  (via drill 0.25)
  Top 0.35: P100.20 v38.92,6.37
  Bottom 0.35: v38.92,6.37 P102.20
PA9  (via drill 0.25)
  Top 0.35: P100.32 v32.92,6.37
  Bottom 0.35: v32.92,6.37 P102.32
PA10  (via drill 0.25)
  Top 0.35: P100.16 v40.92,6.37
  Bottom 0.35: v40.92,6.37 P102.16
PA15  (via drill 0.25)
  Top 0.35: P100.30 v33.92,6.37
  Bottom 0.35: v33.92,6.37 P102.30
PB2  (via drill 0.25)
  Top 0.35: P100.6 v45.92,6.37
  Bottom 0.35: v45.92,6.37 P102.6
PB10  (via drill 0.25)
  Top 0.1: P100.54 21.92,6.97 v21.52,6.57 20.82,5.87 19.17,5.87 18.42,5.12 7.37,5.12 4.92,7.57 4.92,15.12 5.25,15.45 EE_SCL.TP 7.5,15.45 8.12,16.07 8.12,16.67 8.3,16.85 D125.P$1 U105.P$6
  Bottom 0.35: P102.54 21.92,6.97 v21.52,6.57
PB11  (via drill 0.25)
  Top 0.1: P100.52 22.92,7.67 22.82,7.57 22.82,6.67 v22.72,6.57 22.27,6.12 21.42,6.12 20.92,5.62 19.42,5.62 18.67,4.87 7.22,4.87 4.67,7.42 4.67,17.12 5.54,17.99 EE_SDA.TP 7.06,16.85 D126.P$1 8.17,17.6 U105.P$5
  Bottom 0.35: P102.52 22.92,6.77 v22.72,6.57
PC0  (via drill 0.25)
  Top 0.15: P100.4 46.92,9.62 46.42,10.12 46.42,14.02 39.92,20.52 39.92,22.37 39.7,22.6 U210.4
  Top 0.35: P100.4 v46.92,6.37
  Bottom 0.35: P102.4 v46.92,6.37
PC1  (via drill 0.25)
  Top 0.15: U210.3 40.35,22.55 40.17,22.37 40.17,20.62 47.42,13.37 47.42,10.37 47.92,9.87 P100.2
  Top 0.35: P100.2 v47.92,6.37
  Bottom 0.35: P102.2 v47.92,6.37
PC3  (via drill 0.25)
  Top 0.1: D235.P$1 29.19,20.97 24.19,15.97 SENSOR_OUT.TP 15.02,15.97 12.27,13.22 12.27,9.52 12.92,8.87 P100.72 12.92,8.12
  Top 0.2: D235.P$1 R231.2 28.65,23.25 U230.4
  Top 0.35: 12.92,8.12 v12.92,6.37
  Bottom 0.35: P102.72 v12.92,6.37
PC7  (via drill 0.25)
  Top 0.35: v36.92,13.12 P100.23
  Bottom 0.35: P102.23 v36.92,13.12
PC8  (via drill 0.25)
  Top 0.35: P100.18 v39.92,6.37
  Bottom 0.35: v39.92,6.37 P102.18
PC9  (via drill 0.25)
  Top 0.3: P100.33 v31.92,13.12
  Bottom 0.35: v31.92,13.12 P102.33
PC12  (via drill 0.25)
  Top 0.1: P100.74
  Top 0.35: 11.92,8.37 P100.74 v11.92,6.37
  Bottom 0.35: P102.74 v11.92,6.37
PC14  (via drill 0.25)
  Top 0.35: P100.25 v35.92,13.12
  Bottom 0.35: v35.92,13.12 P102.25
PC15  (via drill 0.25)
  Top 0.35: P100.27 v34.92,13.12
  Bottom 0.35: v34.92,13.12 P102.27
PD6  (via drill 0.25)
  Top 0.35: P100.24 v36.92,6.37
  Bottom 0.35: v36.92,6.37 P102.24
PD7  (via drill 0.25)
  Top 0.35: P100.31 v32.92,13.12
  Bottom 0.35: v32.92,13.12 P102.31
PE7  (via drill 0.25)
  Top 0.35: P100.29 v33.92,13.12
  Bottom 0.35: v33.92,13.12 P102.29
PG9  (via drill 0.25)
  Top 0.1: v10.92,6.37 9.92,5.37 7.42,5.37 5.17,7.62 5.17,12.37 5.71,12.91 EE_WP.TP 6.71,12.91 9.65,15.85 D124.P$1 R108.2 9.55,16.44 9.32,16.67 9.32,17.37 9.17,17.52 U105.P$7
  Top 0.35: P100.76 v10.92,6.37
  Bottom 0.35: P102.76 v10.92,6.37
PG10  (via drill 0.25)
  Top 0.1: v9.92,6.37 9.42,5.87 8.17,5.87 7.92,6.12 7.92,13.37 8.92,14.37 12.42,14.37 20.72,22.67 21.44,22.67 21.44,25.25 23.86,27.67 DEMO_EN1.TP 27.12,27.67 v27.42,27.67 | v31.88,26.61 31.88,23.23 31.32,22.67 30.52,22.67 30.19,23 R202.1
  Top 0.2: U200.B2 30.62,24.07 30.19,23.64 R202.1 29.92,23.37 29.42,23.87 U230.5
  Top 0.35: P100.78 v9.92,6.37
  Bottom 0.1: v27.42,27.67 30.12,27.67 31.12,26.67 31.81,26.67 v31.88,26.61
  Bottom 0.35: v9.92,6.37 P102.78
PG12  (via drill 0.25)
  Top 0.25: 8.92,8.37 P100.80
  Top 0.35: 8.92,8.37 P100.80 v8.92,6.37
  Bottom 0.35: v8.92,6.37 P102.80
PH0  (via drill 0.25)
  Top 0.35: P100.70 v13.92,6.37
  Bottom 0.35: P102.70 v13.92,6.37
POWERGOOD
  Top 0.1: Q121.1 24.31,5.67 U120.2
SENSOR_RAW
  Top 0.1: RT222.1 26.67,25.12
  Top 0.2: U230.1 D223.P$1 RT222.1 | 26.67,25.12 26.92,25.37 C233.1 | C233.1 R224.2 | C225.1 C233.1
  Top 0.25: M220.G1 23.81,18.67 26.32,21.18 26.32,23.67 26.65,24 D223.P$1
TE  (via drill 0.25)
  Top 0.3: P100.35 v30.92,13.12
  Bottom 0.35: v30.92,13.12 P102.35
USB_DN  (via drill 0.25)
  Top 0.1: 9.92,10.9 10.2,10.63 | 10.2,10.63 10.27,10.55 10.27,9.95 v10.12,9.8 | P100.77 9.92,11.52 P100.77 | P100.77 9.92,10.9 | 9.92,10.9 10.2,10.63
  Bottom 0.1: P102.77 9.92,10.75 10.27,10.4 10.27,9.95 v10.12,9.8
USB_DP  (via drill 0.25)
  Top 0.1: P100.75 10.92,10.9 10.57,10.55 10.57,10 v10.77,9.8
  Bottom 0.1: P102.75 10.92,10.75 10.57,10.4 10.57,10 v10.77,9.8
VBUS  (via drill 0.25)
  Top 0.3: P100.11 P102.11
  Top 0.7: P102.11 v42.92,13.62
  Bottom 0.4: P102.11 42.92,12.77
  Bottom 0.8: 42.92,12.77 v42.92,13.12 v42.92,13.62
VSYS  (via drill 0.25)
  Top 0.35: P100.17 v39.92,13.12
  Bottom 0.35: v39.92,13.12 P102.17
(copper drawn outside any net)
  shapes: Bottom circle x12, Top circle x12